# Altium schematic sheet STM32.SchDoc
size 381 x 241 mm
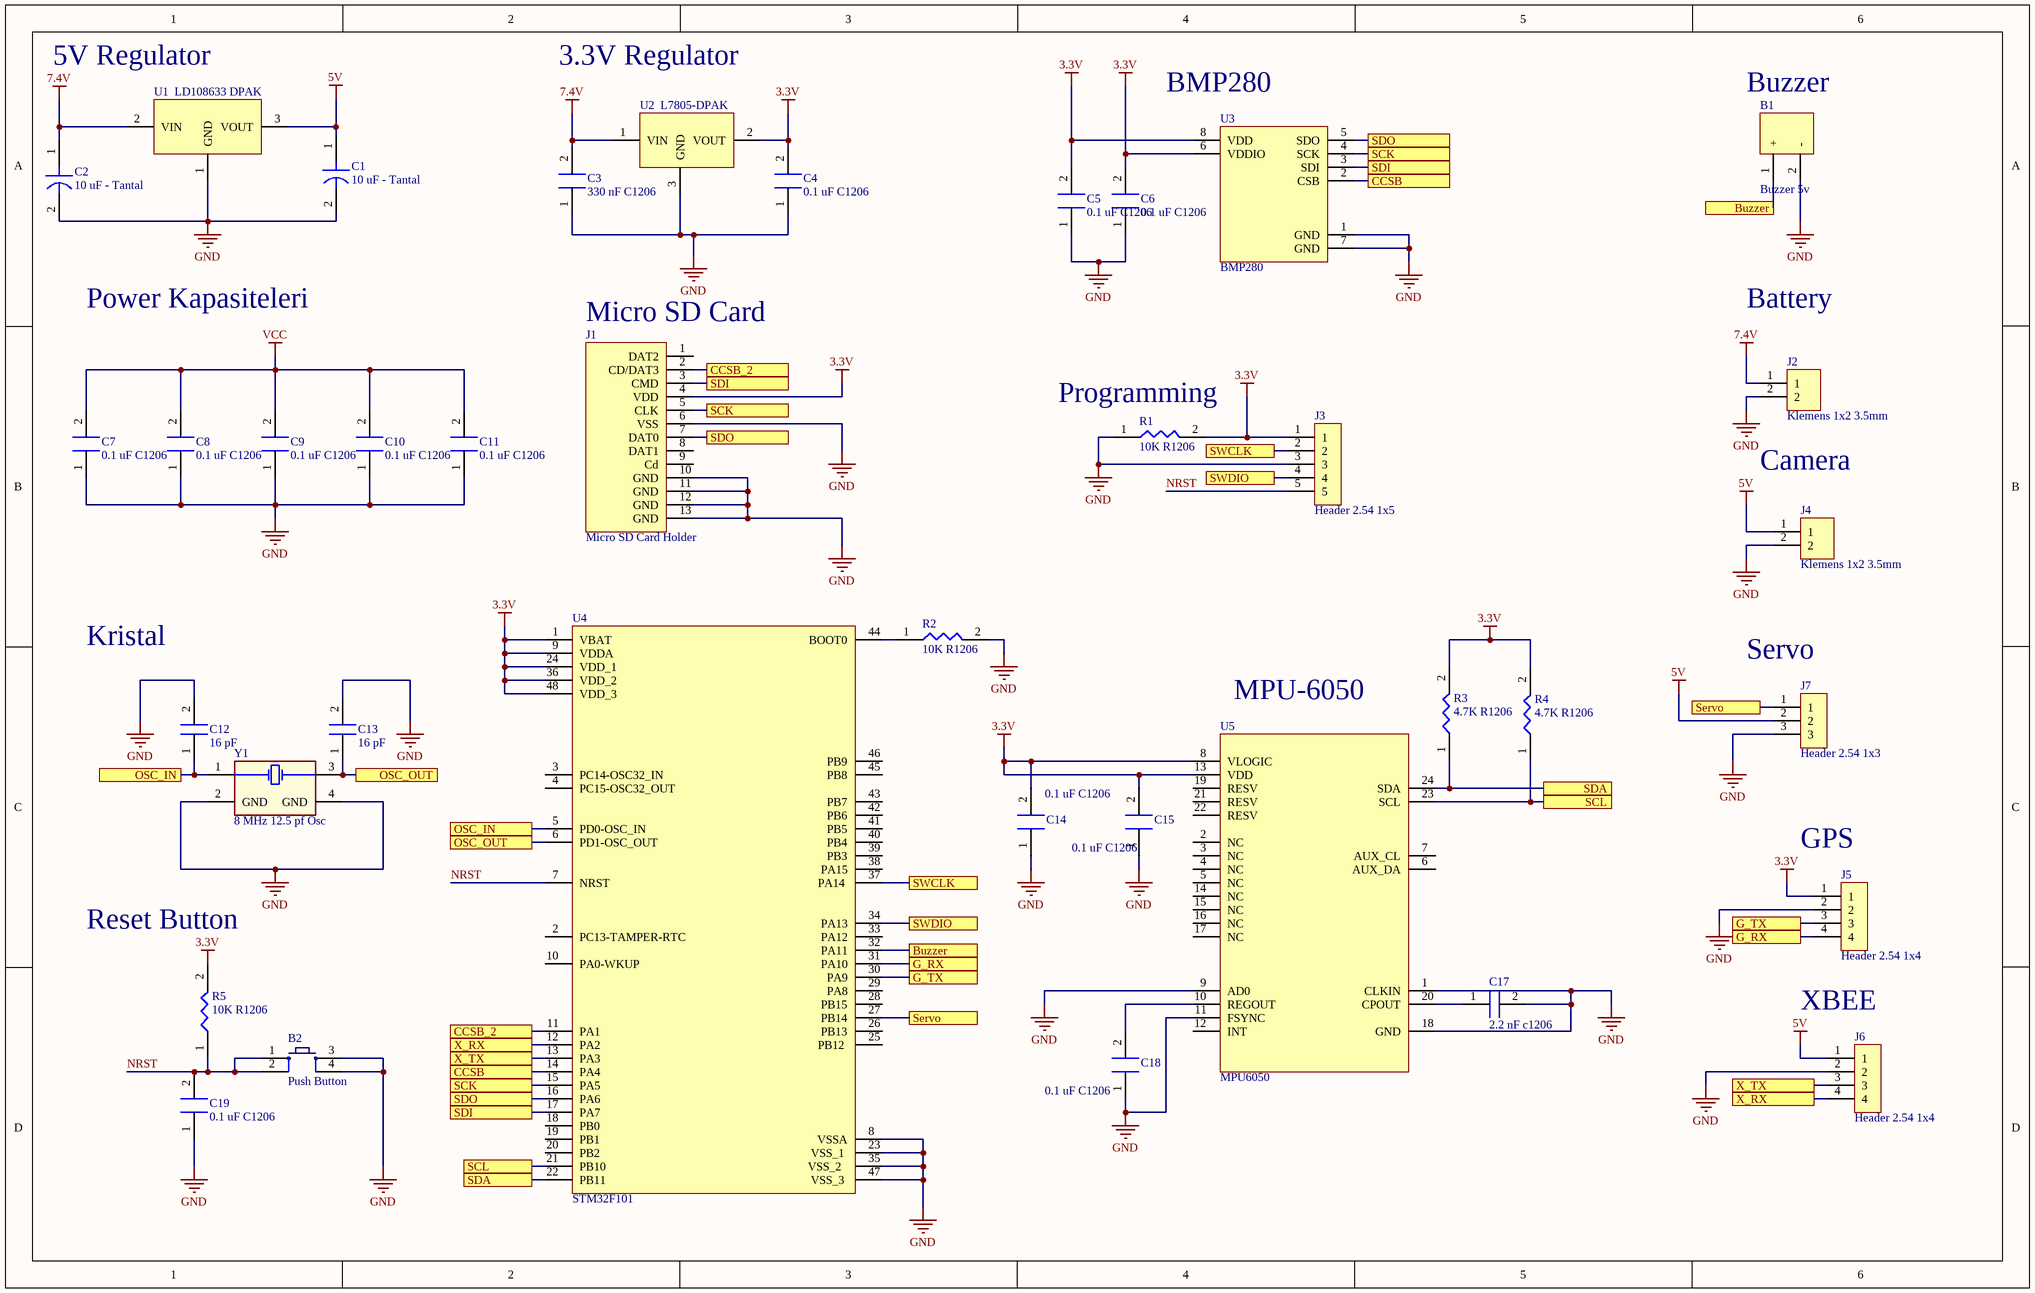
[diagram p0: STM32.SchDoc]

## Parts
B1  Buzzer 5v  [Buzzer 5v]
B2  Push Button  [PUSB BUTTON-SMD]
C1  10 uF - Tantal  [C1206- TANTAL]
C2  10 uF - Tantal  [C1206- TANTAL]
C3  330 nF C1206  [C1206]
C4  0.1 uF C1206  [C1206]
C5  0.1 uF C1206  [C1206]
C6  0.1 uF C1206  [C1206]
C7  0.1 uF C1206  [C1206]
C8  0.1 uF C1206  [C1206]
C9  0.1 uF C1206  [C1206]
C10  0.1 uF C1206  [C1206]
C11  0.1 uF C1206  [C1206]
C12  16 pF  [C1206]
C13  16 pF  [C1206]
C14  0.1 uF C1206  [C1206]
C15  0.1 uF C1206  [C1206]
C17  2.2 nF c1206  [C1206]
C18  0.1 uF C1206  [C1206]
C19  0.1 uF C1206  [C1206]
J1  Micro SD Card Holder  [Micro SD Card Holder]
J2  Klemens 1x2 3.5mm  [Klemens 1x2 - 3.5mm]
J3  Header 2.54 1x5  [Header 2.54 1x5]
J4  Klemens 1x2 3.5mm  [Klemens 1x2 - 3.5mm]
J5  Header 2.54 1x4  [Header 2.54 1x4]
J6  Header 2.54 1x4  [Header 2.54 1x4]
J7  Header 2.54 1x3  [Header 2.54 1x3]
R1  10K R1206  [R1206 Resıstor]
R2  10K R1206  [R1206 Resıstor]
R3  4.7K R1206  [R1206 Resıstor]
R4  4.7K R1206  [R1206 Resıstor]
R5  10K R1206  [R1206 Resıstor]
U1  LD108633 DPAK  [DPAK228P972X230-3N]
U2  L7805-DPAK  [DPAK228P972X230-3N]
U3  BMP280  [BMP280]
U4  STM32F101  [LQFP48-STM]
U5  MPU6050  [QFN50P400X400X90_HS-25N]
Y1  8 MHz 12.5 pf Osc  [8 MHZ Osc.]

## Ports
Buzzer, CCSB, CCSB_2, G_RX, G_TX, OSC_IN, OSC_OUT, SCK, SCL, SDA, SDI, SDO, Servo, SWCLK, SWDIO, X_RX, X_TX

## Nets
3.3V: C4.2 C5.2 C6.2 C14.2 C15.2 J1.4(VDD) J3.1 J5.1 R1.2 R3.2 R4.2 R5.2 U2.2(VOUT) U3.6(VDDIO) U3.8(VDD) U4.1(VBAT) U4.9(VDDA) U4.24(VDD_1) U4.36(VDD_2) U4.48(VDD_3) U5.8(VLOGIC) U5.13(VDD)
5V: C1.1 J4.1 J6.1 J7.2 U1.3(VOUT)
7.4V: C2.1 C3.2 J2.1 U1.2(VIN) U2.1(VIN)
GND: B1.2(-) B2.3 B2.4 C1.2 C2.2 C3.1 C4.1 C5.1 C6.1 C7.1 C8.1 C9.1 C10.1 C11.1 C12.2 C13.2 C14.1 C15.1 C17.2 C18.1 C19.1 J1.6(VSS) J1.10(GND) J1.11(GND) J1.12(GND) J1.13(GND) J2.2 J3.3 J4.2 J5.2 J6.2 J7.3 R1.1 R2.2 U1.1(GND) U2.3(GND) U3.1(GND) U3.7(GND) U4.8(VSSA) U4.23(VSS_1) U4.35(VSS_2) U4.47(VSS_3) U5.1(CLKIN) U5.9(AD0) U5.11(FSYNC) U5.18(GND) Y1.2(GND) Y1.4(GND)
VCC: C7.2 C8.2 C9.2 C10.2 C11.2
Buzzer: B1.1(+) U4.32(PA11) ; port Buzzer
CCSB: U3.2(CSB) U4.14(PA4) ; port CCSB
CCSB_2: J1.2(CD/DAT3) U4.11(PA1) ; port CCSB_2
G_RX: J5.4 U4.31(PA10) ; port G_RX
G_TX: J5.3 U4.30(PA9) ; port G_TX
NRST: B2.1 B2.2 C19.2 J3.5 R5.1 U4.7(NRST)
OSC_IN: C12.1 U4.5(PD0-OSC_IN) Y1.1 ; port OSC_IN
OSC_OUT: C13.1 U4.6(PD1-OSC_OUT) Y1.3 ; port OSC_OUT
SCK: J1.5(CLK) U3.4(SCK) U4.15(PA5) ; port SCK
SCL: R4.1 U4.21(PB10) U5.23(SCL) ; port SCL
SDA: R3.1 U4.22(PB11) U5.24(SDA) ; port SDA
SDI: J1.3(CMD) U3.3(SDI) U4.17(PA7) ; port SDI
SDO: J1.7(DAT0) U3.5(SDO) U4.16(PA6) ; port SDO
Servo: J7.1 U4.27(PB14) ; port Servo
SWCLK: J3.2 U4.37(PA14) ; port SWCLK
SWDIO: J3.4 U4.34(PA13) ; port SWDIO
X_RX: J6.4 U4.12(PA2) ; port X_RX
X_TX: J6.3 U4.13(PA3) ; port X_TX
NetC17_1: C17.1 U5.20(CPOUT)
NetC18_2: C18.2 U5.10(REGOUT)
NetR2_1: R2.1 U4.44(BOOT0)

Not connected (* = marked no-connect by the designer): J1 1(DAT2) 8(DAT1) 9(Cd); U4 2(PC13-TAMPER-RTC) 3(PC14-OSC32_IN) 4(PC15-OSC32_OUT) 10(PA0-WKUP) 18(PB0) 19(PB1) 20(PB2) 25(PB12_) 26(PB13) 28(PB15) 29(PA8) 33(PA12) 38(PA15) 39(PB3) 40(PB4) 41(PB5) 42(PB6) 43(PB7) 45(PB8) 46(PB9); U5 2(NC) 3(NC) 4(NC) 5(NC) 6(AUX_DA) 7(AUX_CL) 12(INT) 14(NC) 15(NC) 16(NC) 17(NC) 19(RESV) 21(RESV) 22(RESV)

## Notes on the sheet
- 5V Regulator
- 3.3V Regulator
- (near U3) BMP280
- Buzzer
- Power Kapasiteleri
- (near J1) Micro SD Card
- Battery
- (near R1) Programming
- Camera
- Kristal
- MPU-6050
- (near J7) Servo
- (near J5) GPS
- Reset Button
- XBEE

## Library data of the parts
B2 = Push Button: Smd Push Button
U1 = LD108633 DPAK: LD1086 3.3V REGULATOR
U2 = L7805-DPAK: L7805 5V REGULATOR. SMD PAKET
U4 = STM32F101: STM32F101 48 PİNLİ MİKROİŞLEMCİ
U5 = MPU6050: MPU6050 GYRO